# EAGLE design single-supply-bridged (EAGLE 5.10)
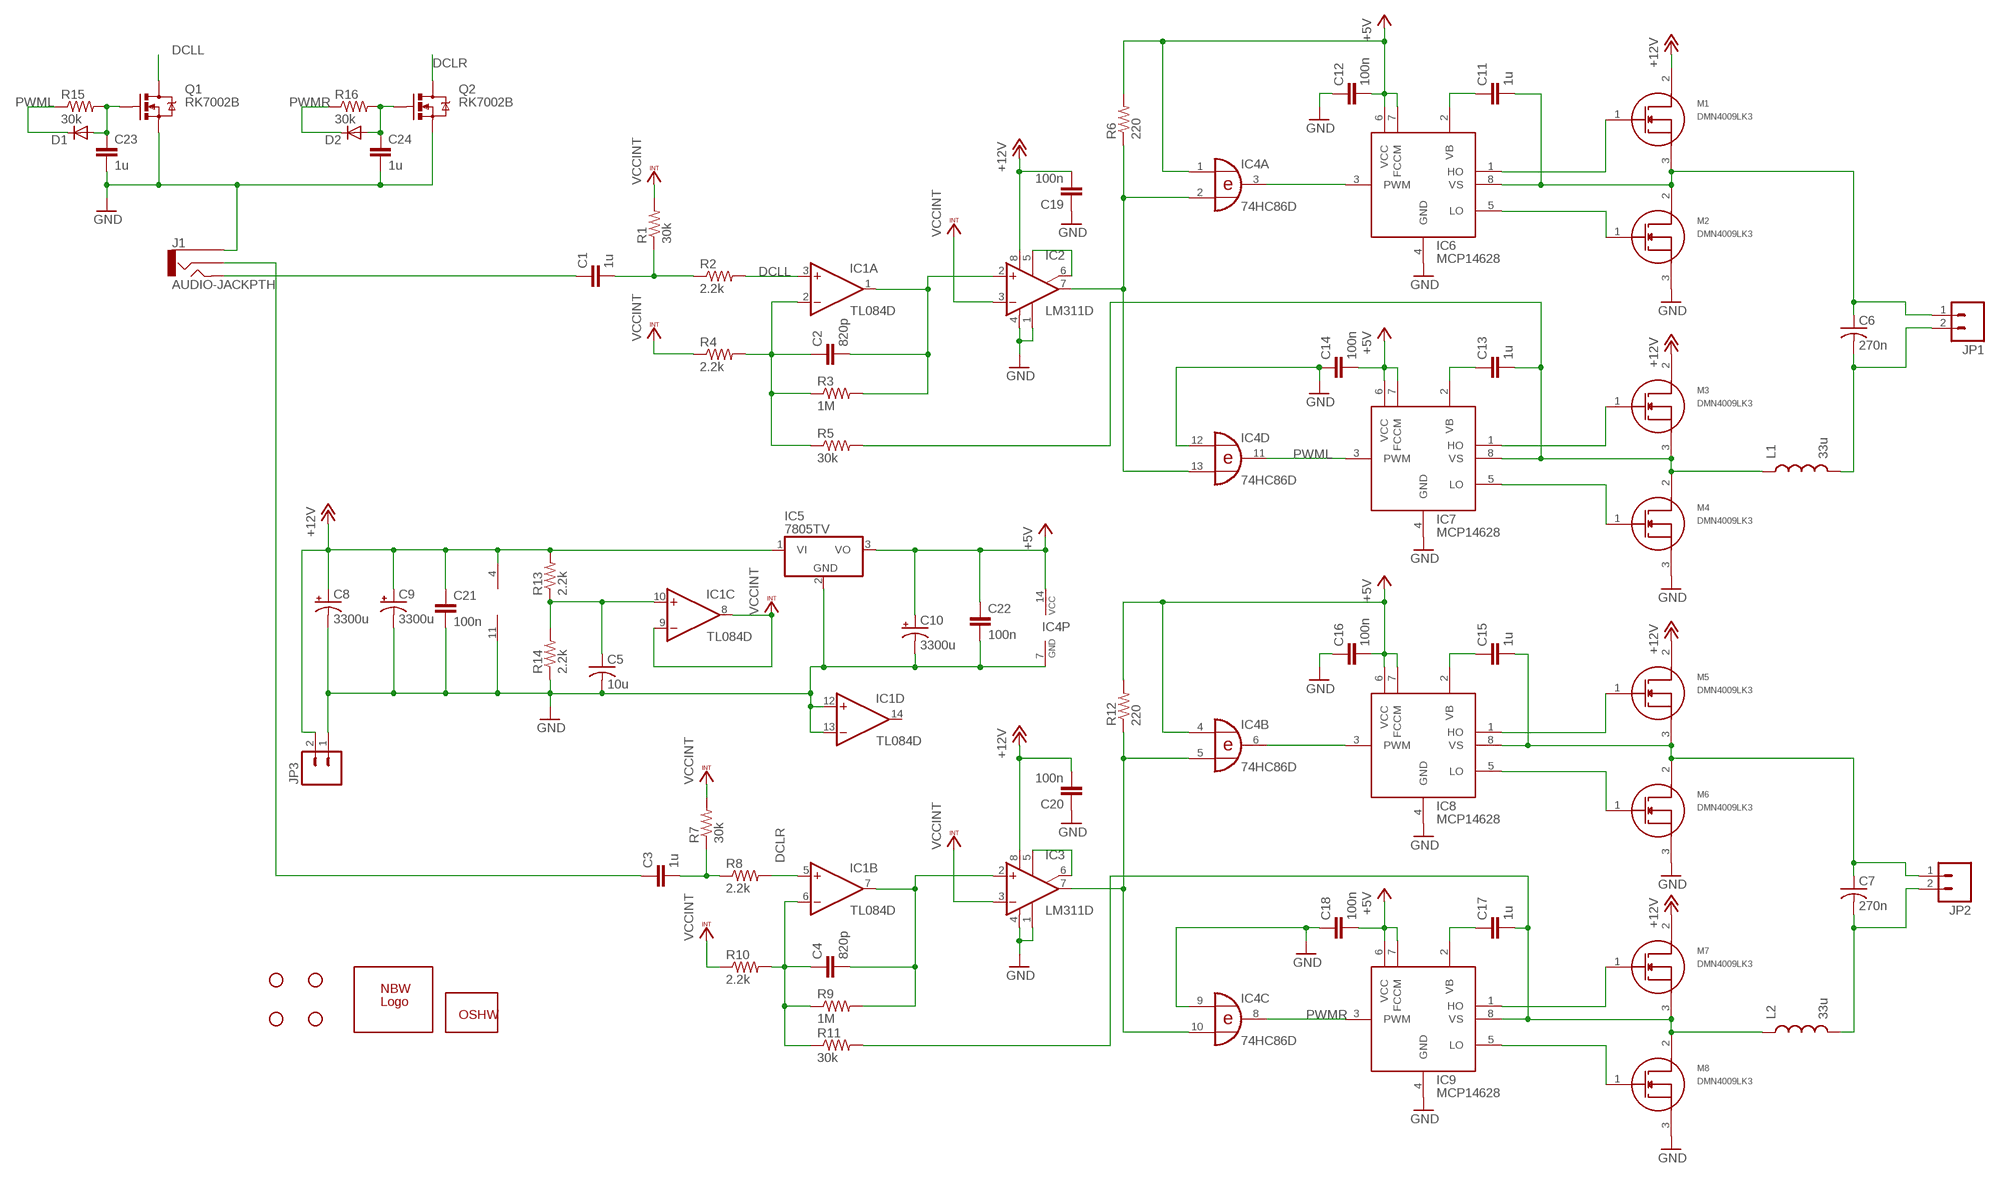
[diagram p0: schematic, sheet 1]

## Parts
C1  1u  CAP0603  [0603]
C2  820p  CAP0603  [0603]
C3  1u  CAP0603  [0603]
C4  820p  CAP0603  [0603]
C5  10u  C-USC0805  [C0805]
C6  270n  C-USC1210K  [C1210K]
C7  270n  C-USC1210K  [C1210K]
C8  3300u  CPOL-USE7.5-18  [E7,5-18]
C9  3300u  CPOL-USE7.5-18  [E7,5-18]
C10  3300u  CPOL-USE7.5-18  [E7,5-18]
C11  1u  CAP0603  [0603]
C12  100n  CAP0603  [0603]
C13  1u  CAP0603  [0603]
C14  100n  CAP0603  [0603]
C15  1u  CAP0603  [0603]
C16  100n  CAP0603  [0603]
C17  1u  CAP0603  [0603]
C18  100n  CAP0603  [0603]
C19  100n  CAP0603  [0603]
C20  100n  CAP0603  [0603]
C21  100n  CAP0603  [0603]
C22  100n  CAP0603  [0603]
C23  1u  CAP0603  [0603]
C24  1u  CAP0603  [0603]
D1  DIODESMB  [SMB-DIODE]
D2  DIODESMB  [SMB-DIODE]
GOLD_ORB_SM1  OSHWLOGO_GOLD_ORB_SM  [OSHW2]
IC1  TL084D  [SO14]
IC2  LM311D  [SO08]
IC3  LM311D  [SO08]
IC4  74HC86D  [SO14]
IC5  7805TV  [TO220V]
IC6  MCP14628  [SO-08]
IC7  MCP14628  [SO-08]
IC8  MCP14628  [SO-08]
IC9  MCP14628  [SO-08]
J1  AUDIO-JACKPTH  [AUDIO-JACK]
JP1  M023.5MM  [SCREWTERMINAL-3.5MM-2]
JP2  M023.5MM  [SCREWTERMINAL-3.5MM-2]
JP3  M023.5MM  [SCREWTERMINAL-3.5MM-2]
L1  33u  INDUCTORPWR  [CDRH125]
L2  33u  INDUCTORPWR  [CDRH125]
M1  DMN4009LK3  [TO252-3L]
M2  DMN4009LK3  [TO252-3L]
M3  DMN4009LK3  [TO252-3L]
M4  DMN4009LK3  [TO252-3L]
M5  DMN4009LK3  [TO252-3L]
M6  DMN4009LK3  [TO252-3L]
M7  DMN4009LK3  [TO252-3L]
M8  DMN4009LK3  [TO252-3L]
Q1  RK7002B  MOSFET-NCHANNELSMD  [SOT23-3]
Q2  RK7002B  MOSFET-NCHANNELSMD  [SOT23-3]
R1  30k  RESISTOR0603  [0603]
R2  2.2k  RESISTOR0603  [0603]
R3  1M  RESISTOR0603  [0603]
R4  2.2k  RESISTOR0603  [0603]
R5  30k  RESISTOR0603  [0603]
R6  220  RESISTOR0603  [0603]
R7  30k  RESISTOR0603  [0603]
R8  2.2k  RESISTOR0603  [0603]
R9  1M  RESISTOR0603  [0603]
R10  2.2k  RESISTOR0603  [0603]
R11  30k  RESISTOR0603  [0603]
R12  220  RESISTOR0603  [0603]
R13  2.2k  RESISTOR0603  [0603]
R14  2.2k  RESISTOR0603  [0603]
R15  30k  RESISTOR0603  [0603]
R16  30k  RESISTOR0603  [0603]
U$1  STAND-OFF  [STAND-OFF]
U$2  STAND-OFF  [STAND-OFF]
U$3  STAND-OFF  [STAND-OFF]
U$4  STAND-OFF  [STAND-OFF]
U$5  NBW_LOGOSMALL  [NBW_LOGO]

## Nets
+12V: C8.+ C9.+ C19.2 C20.2 C21.1 IC1.4(P:V+) IC2.8(V+) IC3.8(V+) IC5.1(VI) JP3.2 M1.2 M3.2 M5.2 M7.2 R13.2
DCLL: IC1.3(A:+IN) Q1.3(D) R2.2
DCLR: IC1.5(B:+IN) Q2.3(D) R8.2
GND: C5.2 C8.- C9.- C10.- C12.1 C14.1 C16.1 C18.1 C19.1 C20.1 C21.2 C22.2 C23.2 C24.2 IC1.11(P:V-) IC1.12(D:+IN) IC1.13(D:-IN) IC2.1(GND) IC2.4(V-) IC3.1(GND) IC3.4(V-) IC4.7(P:GND) IC4.9(C:I0) IC4.12(D:I0) IC5.2(GND) IC6.4(GND) IC7.4(GND) IC8.4(GND) IC9.4(GND) J1.1 JP3.1 M2.3 M4.3 M6.3 M8.3 Q1.2(S) Q2.2(S) R14.1
N$1: C11.1 IC6.2(VB)
N$2: C1.2 R1.1 R2.1
N$3: C6.1 C11.2 IC6.8(VS) JP1.1 M1.3 M2.2
N$4: IC6.1(HO) M1.1
N$5: IC6.5(LO) M2.1
N$6: C13.2 IC7.8(VS) L1.1 M3.3 M4.2 R5.2
N$7: C13.1 IC7.2(VB)
N$8: IC7.1(HO) M3.1
N$9: IC7.5(LO) M4.1
N$10: C10.+ C12.2 C14.2 C16.2 C18.2 C22.1 IC4.1(A:I0) IC4.4(B:I0) IC4.14(P:VCC) IC5.3(VO) IC6.6(VCC) IC6.7(FCCM) IC7.6(VCC) IC7.7(FCCM) IC8.6(VCC) IC8.7(FCCM) IC9.6(VCC) IC9.7(FCCM) R6.2 R12.2 ; supply symbol labelled +5V
N$11: IC4.3(A:O) IC6.3(PWM)
N$12: C1.1 J1.5
N$13: C15.1 IC8.2(VB)
N$14: IC2.5(ON) IC2.6(ON/STR)
N$15: IC8.1(HO) M5.1
N$16: IC8.5(LO) M6.1
N$17: IC4.6(B:O) IC8.3(PWM)
N$18: C3.1 J1.2
N$19: C2.1 IC1.2(A:-IN) R3.1 R4.2 R5.1
N$20: C2.2 IC1.1(A:OUT) IC2.2(+IN) R3.2
N$21: C17.1 IC9.2(VB)
N$22: C17.2 IC9.8(VS) L2.1 M7.3 M8.2 R11.2
N$23: IC9.1(HO) M7.1
N$24: IC9.5(LO) M8.1
N$25: C7.2 JP2.2 L2.2
N$26: IC2.7(OUT) IC4.2(A:I1) IC4.13(D:I1) R6.1
N$27: C6.2 JP1.2 L1.2
N$28: C24.1 D2.A Q2.1(G) R16.2
N$29: C23.1 D1.A Q1.1(G) R15.2
N$30: IC3.5(ON) IC3.6(ON/STR)
N$32: IC3.7(OUT) IC4.5(B:I1) IC4.10(C:I1) R12.1
N$33: C3.2 R7.1 R8.1
N$35: C4.1 IC1.6(B:-IN) R9.1 R10.2 R11.1
N$36: C4.2 IC1.7(B:OUT) IC3.2(+IN) R9.2
N$37: C7.1 C15.2 IC8.8(VS) JP2.1 M5.3 M6.2
N$42: C5.1 IC1.10(C:+IN) R13.1 R14.2
PWML: D1.C IC4.11(D:O) IC7.3(PWM) R15.1
PWMR: D2.C IC4.8(C:O) IC9.3(PWM) R16.1
VCCINT: IC1.8(C:OUT) IC1.9(C:-IN) IC2.3(-IN) IC3.3(-IN) R1.2 R4.1 R7.2 R10.1
Unconnected: IC1.14(D:OUT)

## Library data of the parts
C1-C4 C11-C24 = SparkFun:CAP: Capacitor Standard 0603 ceramic capacitor, and 0.1" leaded capacitor.
C5-C7 = rcl:C-US: CAPACITOR, American symbol
C8-C10 = rcl:CPOL-US: POLARIZED CAPACITOR, American symbol
D1 D2 = SparkFun:DIODE: Diode These are standard reverse protection diodes and small signal diodes. SMA package can handle up to about 1A. SOD-323 can handle about 200mA. What the SOD-323 package when ordering, there are some mfgs out there that are 5-pin packages.
GOLD_ORB_SM1 = NBitWonder:OSHWLOGO: These are Open-Source Hardware logos.
IC1 = linear:TL084: OP AMP
IC2 IC3 = linear:LM311: COMPARATOR
IC4 = 74xx-eu:74*86: Quad 2-input EXCLUSIVE-OR (XOR) gate
IC5 = linear:78*: Positive VOLTAGE REGULATOR Source: http://cache.national.com/ds/LM/LM78L05.pdf http://www.fairchildsemi.com/ds/LM/LM7805.pdf
IC6-IC9 = NBitWonder:MCP14628
J1 = SparkFun:AUDIO-JACK: 3.5mm Audio Jack Simple 3.5mm common PCB mount audio jack. SKU: PRT-08032
JP1-JP3 = SparkFun:M02: Header 2 Standard 2-pin 0.1" header. Use with straight break away headers (SKU : PRT-00116), right angle break away headers (PRT-00553), swiss pins (PRT-00743), machine pins (PRT-00117), and female headers (PRT-00115). Molex polarized connector foot print use with SKU : PRT-08233 with associated crimp pins and housings.
L1 L2 = SparkFun:INDUCTOR: Inductors Basic Inductor/Choke - 0603 and 1206. Footprints are not proven and vary greatly between part numbers.
M1-M8 = NBitWonder:DMN4009LK3
Q1 Q2 = SparkFun:MOSFET-NCHANNEL
R1-R16 = SparkFun:RESISTOR: Resistor Basic schematic elements and footprints for 0603, 1206, and PTH 1/10th watt (small) resistors.
U$1-U$4 = SparkFun:STAND-OFF: Stand Off This is the mechanical footprint for a #4 phillips button head screw. Use the keepout ring to avoid running the screw head into surrounding components. SKU : PRT-00447
U$5 = NBitWonder:NBW_LOGO

## Board
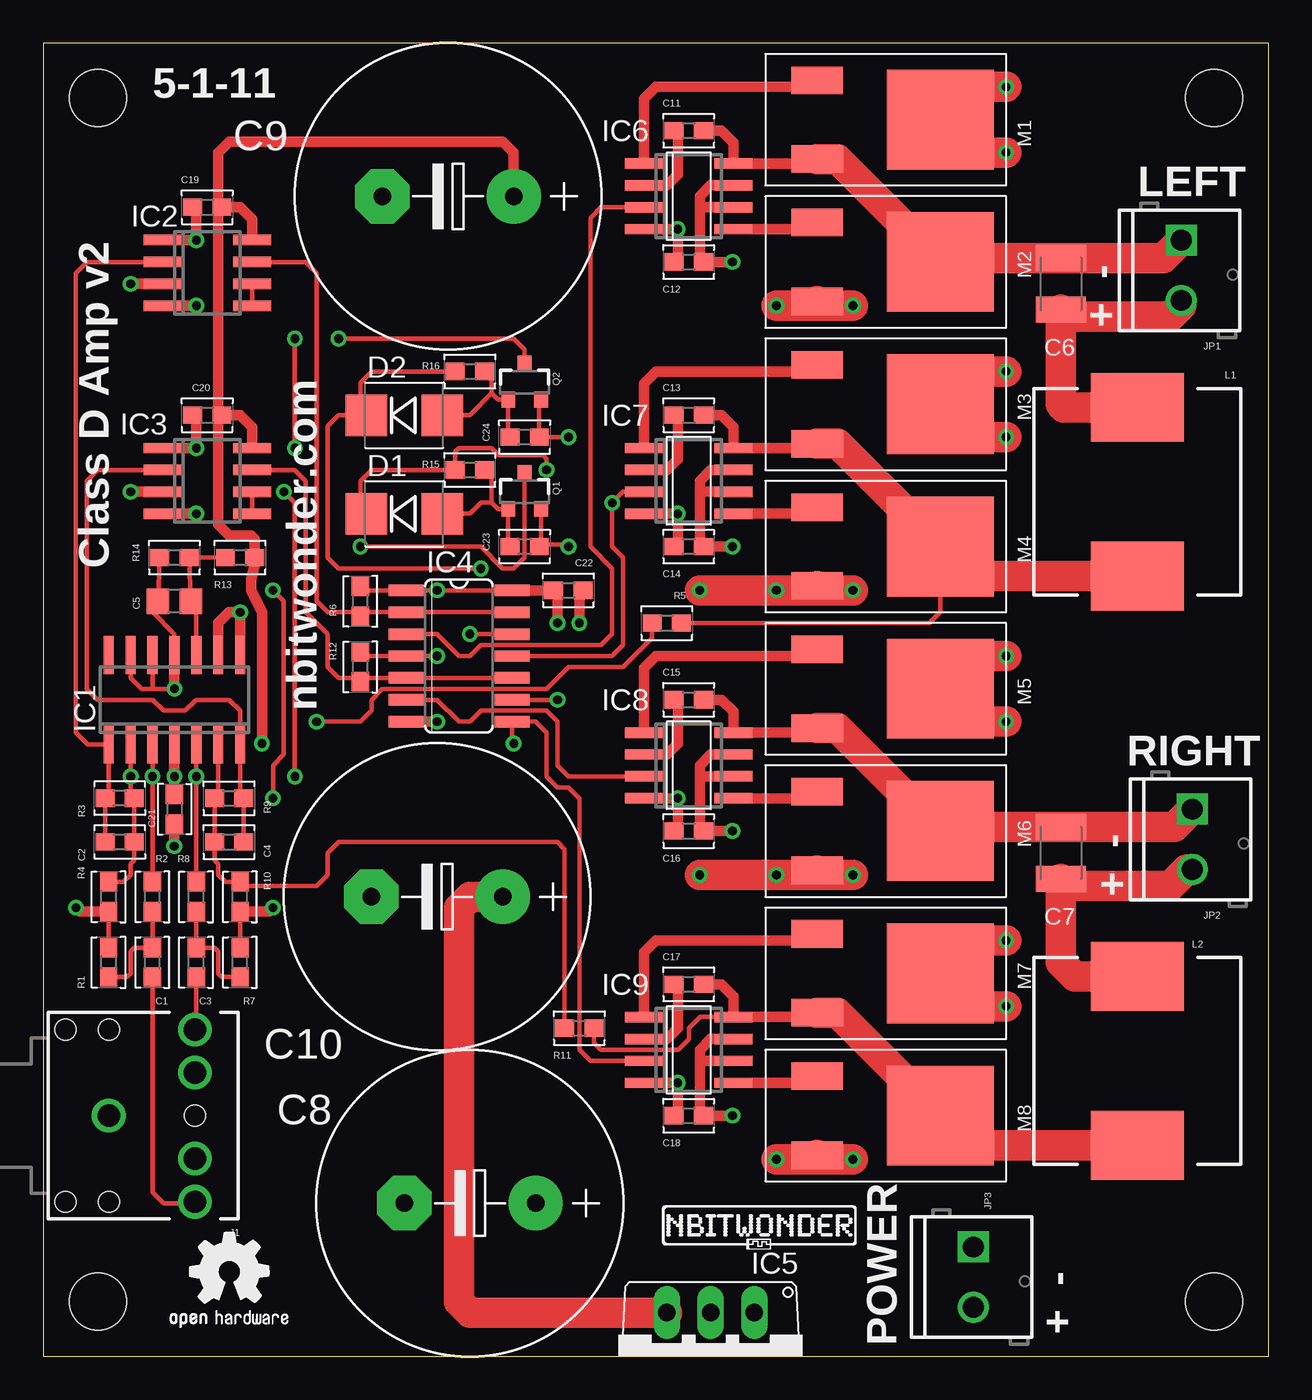
[diagram p1: board, top side]
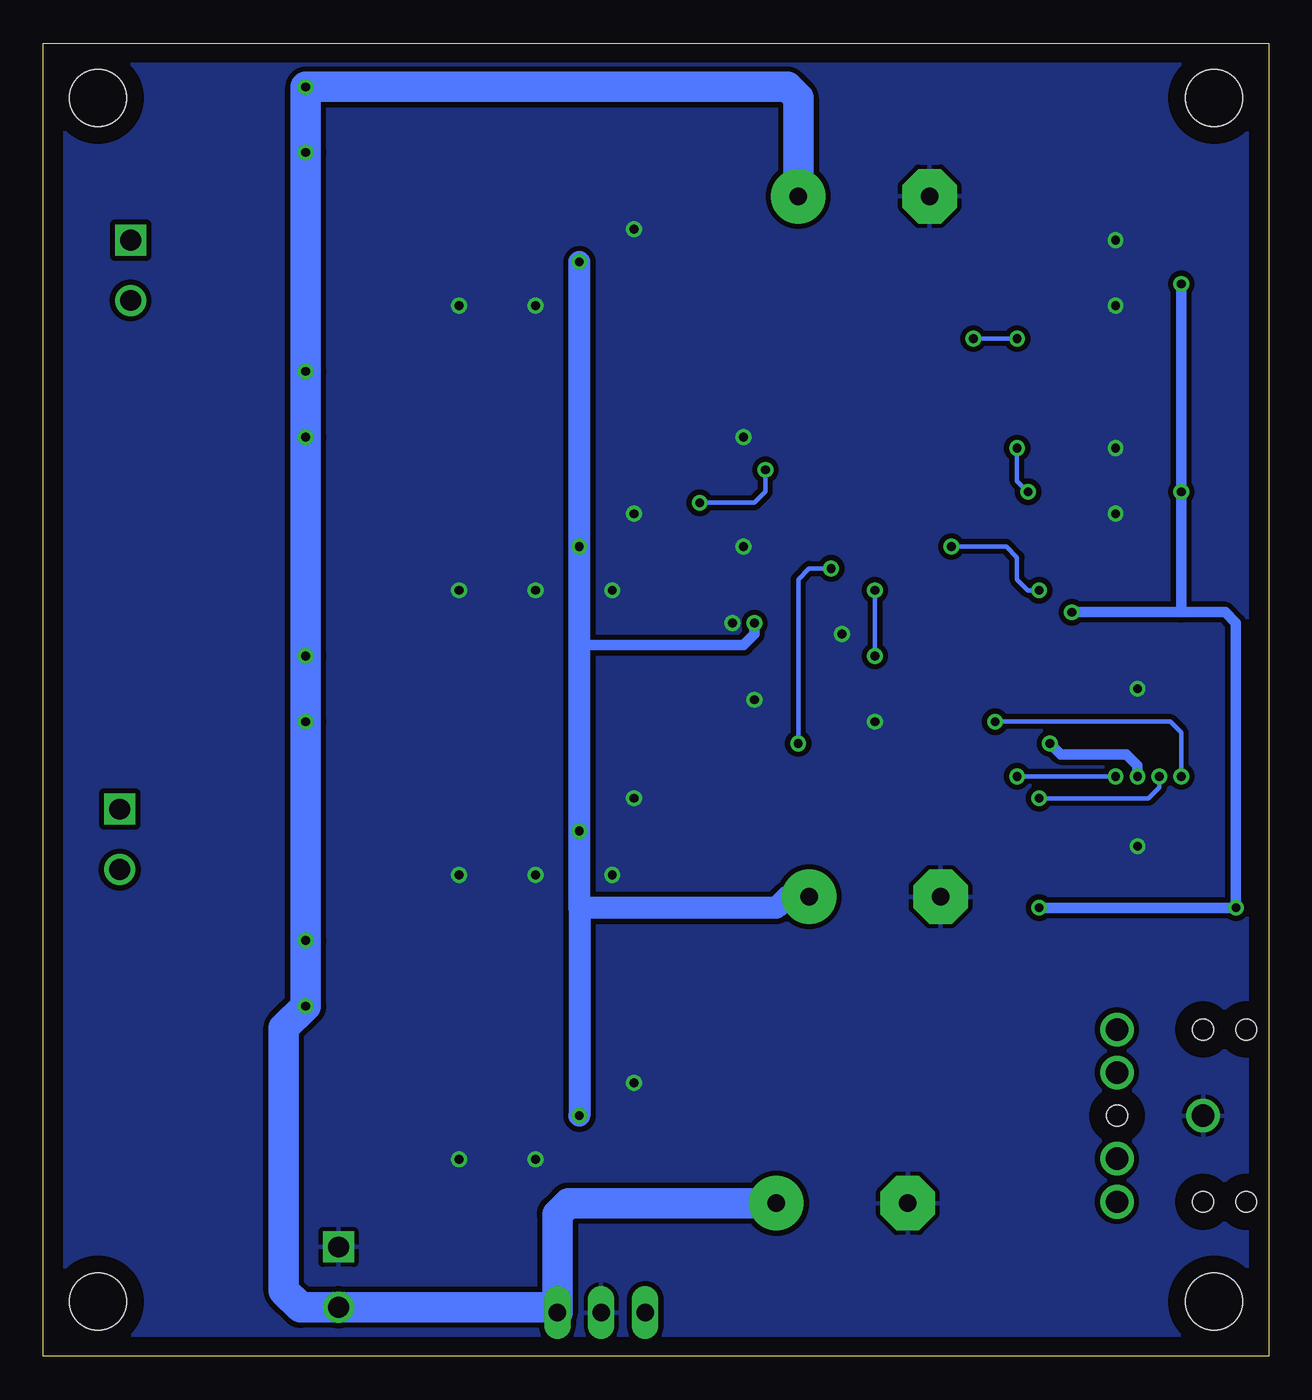
[diagram p2: board, bottom side, seen from below]

Size 71.12 x 76.2 mm. Coordinates in mm from the lower left corner, seen from the top.
Outline: 0,0 71.12,0 71.12,76.2 0,76.2 0,0
Copper layers (1*16): Top 0.035mm / dielectric 1.5mm / Bottom 0.035mm
Design rules "default *": minimum track width 10mil, minimum drill 24mil, track to track 8mil, track to pad 8mil, pad to pad 8mil, via to via 8mil, smd to smd 8mil, copper to edge 40mil, drill to drill 8mil, minimum pad ring 10mil, minimum via ring 8mil, stop-mask expansion 4mil, vias tented up to drill 20mil, thermal gap 10mil

### Footprints (pad centres in the part's own frame; a part is rotated, then mirrored left to right if it is on the bottom)
0603 = smd 1.1 x 1: 1 -0.85,0; 2 0.85,0
C0805 = smd 1.3 x 1.5: 1 -0.95,0; 2 0.95,0
C1210K = smd 1.5 x 2.9: 1 -1.5,0; 2 1.5,0
E7,5-18 = drill 1.016 pad 3.15 round: + -3.81,0 | drill 1.016 pad 3.15 octagon: - 3.81,0
SMB-DIODE = smd 2.4 x 2.4: A 2.2,0; C -2.2,0
SO14 = smd 0.6 x 2.2: 1 -3.81,-2.6; 2 -2.54,-2.6; 3 -1.27,-2.6; 4 0,-2.6; 5 1.27,-2.6; 6 2.54,-2.6; 7 3.81,-2.6; 8 3.81,2.6; 9 2.54,2.6; 10 1.27,2.6; 11 0,2.6; 12 -1.27,2.6; 13 -2.54,2.6; 14 -3.81,2.6
SO08 = smd 0.6 x 2.2: 1 -1.905,-2.6; 2 -0.635,-2.6; 3 0.635,-2.6; 4 1.905,-2.6; 5 1.905,2.6; 6 0.635,2.6; 7 -0.635,2.6; 8 -1.905,2.6
SO14' = smd 0.66 x 2.032: 1 -3.81,-3.073; 2 -2.54,-3.073; 3 -1.27,-3.073; 4 0,-3.073; 5 1.27,-3.073; 6 2.54,-3.073; 7 3.81,-3.073; 8 3.81,3.073; 9 2.54,3.073; 10 1.27,3.073; 11 0,3.073; 12 -1.27,3.073; 13 -2.54,3.073; 14 -3.81,3.073
TO220V = drill 1.016 long: 1 -2.54,-2.54; 2 0,-2.54; 3 2.54,-2.54
SO-08 = smd 0.6 x 2.2: 1 -1.905,-2.6; 2 -0.635,-2.6; 3 0.635,-2.6; 4 1.905,-2.6; 5 1.905,2.6; 6 0.635,2.6; 7 -0.635,2.6; 8 -1.905,2.6
AUDIO-JACK = drill 1.3 round: 1 0,0; 2 5,5; 3 5,2.5; 4 5,-2.5; 5 5,-5 | hole 1.2: 0,5; -2.5,5; -2.5,-5; 0,-5; 5,0
SCREWTERMINAL-3.5MM-2 = drill 1.2 square: 1 0,0 | drill 1.2 round: 2 3.5,0
CDRH125 = smd 5.4 x 4: 1 0,4.9; 2 0,-4.9
TO252-3L = smd 2.997 x 1.6: 1 7.163,-2.286; 3 7.163,2.286 | smd 6.198 x 5.791: 2 0,0
SOT23-3 = smd 0.8 x 0.9: 1 -0.95,-1; 2 0.95,-1; 3 0,1.1
STAND-OFF = hole 3.302: 0,0

### Placement (x,y rotation side)
C1  6.35,22.86 90 top
C2  4.45,29.84 180 top
C3  8.89,22.86 90 top
C4  10.79,29.84 0 top
C5  7.62,43.81 180 top
C6  59.05,62.23 270 top
C7  59.05,29.21 270 top
C8  24.77,8.89 180 top
C9  23.5,67.31 180 top
C10  22.86,26.67 180 top
C11  37.47,71.12 0 top
C12  37.47,63.5 0 top
C13  37.47,54.61 0 top
C14  37.47,46.99 0 top
C15  37.47,38.1 0 top
C16  37.47,30.48 0 top
C17  37.47,21.59 0 top
C18  37.47,13.97 0 top
C19  9.53,66.67 0 top
C20  9.53,54.61 0 top
C21  7.62,31.75 270 top
C22  30.48,44.45 0 top
C23  27.94,46.99 0 top
C24  27.94,53.34 0 top
D1  20.95,48.9 0 top
D2  20.95,54.61 0 top
GOLD_ORB_SM1  6.99,0.64 0 top
IC1  7.62,38.1 0 top
IC2  9.53,62.87 270 top
IC3  9.53,50.8 270 top
IC4  74HC86D  [SO14']  24.13,40.64 270 top
IC5  38.73,0 180 top
IC6  37.47,67.31 270 top
IC7  37.47,50.8 270 top
IC8  37.47,34.29 270 top
IC9  37.47,17.78 270 top
J1  3.81,13.97 0 top
JP1  66.04,64.77 270 top
JP2  66.67,31.75 270 top
JP3  53.98,6.35 270 top
L1  63.5,50.16 180 top
L2  63.5,17.14 180 top
M1  52.07,71.75 180 top
M2  52.07,63.5 180 top
M3  52.07,55.24 180 top
M4  52.07,46.99 180 top
M5  52.07,38.73 180 top
M6  52.07,30.48 180 top
M7  52.07,22.23 180 top
M8  52.07,13.97 180 top
Q1  27.94,50.16 0 top
Q2  27.94,56.52 0 top
R1  3.81,22.86 90 top
R2  6.35,26.67 90 top
R3  4.45,32.38 180 top
R4  3.81,26.67 90 top
R5  36.2,42.55 0 top
R6  18.41,43.81 90 top
R7  11.43,22.86 90 top
R8  8.89,26.67 90 top
R9  10.79,32.38 0 top
R10  11.43,26.67 90 top
R11  31.11,19.05 0 top
R12  18.41,40.01 90 top
R13  11.43,46.35 0 top
R14  7.62,46.35 0 top
R15  24.77,51.44 0 top
R16  24.77,57.15 0 top
U$1  3.17,3.17 0 top
U$2  3.17,73.03 0 top
U$3  67.94,3.17 0 top
U$4  67.94,73.03 0 top
U$5  35.56,5.71 0 top

### Tracks (layer width: path | path; a pad name or v marks a point on that pad's centre or on a via)
+12V  (via drill 0.51)
  Top 0.254: C20.2 10.16,54.4
  Top 0.61: C21.1 v7.62,33.66 IC1.4 | IC2.8 12.12,65.98 11.43,66.67 C19.2 | IC3.8 12.12,53.91 11.43,54.61 C20.2 10.16,54.61 10.16,66.46 C19.2 | 10.16,54.4 10.16,48.26 10.79,47.62 12.06,47.62 12.28,47.41 R13.2 12.28,45.94 12.06,45.09 12.06,44.45 12.7,43.18 v12.7,35.56 | C9.+ 27.3,69.85 26.67,70.48 10.79,70.48 10.16,69.85 10.16,66.89 C19.2
  Top 1.778: v55.88,73.66 54.61,73.66 52.7,71.75 M1.2 53.98,69.85 v55.88,69.85 | v55.88,57.15 53.98,57.15 M3.2 53.98,53.34 v55.88,53.34 | v55.88,40.64 53.98,40.64 M5.2 53.98,36.83 v55.88,36.83 | v55.88,24.13 53.98,24.13 M7.2 53.98,20.32 v55.88,20.32
  Bottom 0.61: v7.62,33.66 7.62,34.29 8.26,34.92 12.06,34.92 v12.7,35.56
  Bottom 1.778: C9.+ 27.3,73.03 27.94,73.66 v55.88,73.66 v55.88,69.85 v55.88,57.15 v55.88,53.34 v55.88,40.64 v55.88,36.83 v55.88,24.13 v55.88,20.32 57.15,19.05 57.15,3.81 56.19,2.85 JP3.2 41.59,2.85 IC5.1 41.27,8.26 40.64,8.89 C8.+
DCLL  (via drill 0.51)
  Top 0.254: R2.2 v6.35,33.66 IC1.3 | Q1.3 27.94,46.35 27.3,45.72 26.67,45.72 25.4,46.99 v18.41,46.99 | v13.34,44.45 13.97,43.81 13.97,34.92 13.34,34.29 v13.34,32.38
  Bottom 0.254: v18.41,46.99 15.24,46.99 14.61,46.35 14.61,45.09 13.97,44.45 v13.34,44.45 | v13.34,32.38 6.99,32.38 6.35,33.02 v6.35,33.66
DCLR  (via drill 0.51)
  Top 0.254: R8.2 v8.89,33.66 IC1.5 | Q2.3 27.94,58.42 27.3,59.05 v17.14,59.05 | v14.61,52.7 v14.61,59.05 | v13.97,50.16 14.61,49.53 v14.61,33.66
  Bottom 0.254: v14.61,59.05 v17.14,59.05 | v14.61,52.7 14.61,50.8 v13.97,50.16 | v8.89,33.66 v14.61,33.66
GND  (via drill 0.51)
  Top 0.254: IC1.13 5.08,39.37 5.71,38.73 6.35,38.73 | 6.35,38.73 v7.62,38.73 | 6.35,38.73 IC1.12 | R14.1 C5.2 6.35,43.81 6.35,43.18 7.62,41.91 7.62,40.64 | 28.89,47.09 Q1.2 | C23.2 28.89,47.09 | Q2.2 28.79,55.41 C24.2 v30.48,53.34 | v24.77,41.91 IC4.12 | 28.89,47.09 30.38,47.09 v30.48,46.99 | IC4.9 v29.84,38.1
  Top 0.61: C21.2 v7.62,29.62 v7.61,29.61 | v7.62,38.73 7.62,40.64 IC1.11 | IC2.1 v8.89,64.77 8.89,66.46 C19.1 | IC2.4 v8.89,60.96 | IC3.1 v8.89,52.7 8.89,54.4 C20.1 | IC3.4 v8.89,48.9 | IC4.7 v22.86,36.83 | IC6.4 v36.83,65.41 36.83,63.72 C12.1 | IC7.4 v36.83,48.9 36.83,47.2 C14.1 | IC8.4 v36.83,32.38 36.83,30.7 C16.1 | IC9.4 v36.83,15.88 36.83,14.19 C18.1 | v31.11,42.55 31.11,44.23 C22.2
  Top 1.778: 44.65,27.94 v46.99,27.94 | v38.1,27.94 v42.55,27.94 44.65,27.94 | 44.65,27.94 M6.3 | v42.55,44.45 v46.99,44.45 | v38.1,44.45 v42.55,44.45 | v42.55,44.45 44.65,44.45 M4.3 | v46.99,60.96 v42.55,60.96 44.65,60.96 M2.3 | v46.99,11.43 v42.55,11.43 44.65,11.43 M8.3
  pour Bottom (isolate 0.305): 1.27,1.27 69.85,1.27 69.85,74.93 1.27,74.93
N$1
  Top 0.61: IC6.2 36.2,67.94 36.83,68.58 36.83,70.91 C11.1
N$2
  Top 0.254: R2.1 C1.2 5.29,23.71 5.08,23.5 5.08,22.23 4.87,22.01 R1.1
N$3
  Top 0.61: M1.3 44.53,69.85 44.45,69.85 43.81,69.22 IC6.8 40.06,70.42 39.37,71.12 C11.2
  Top 1.778: M1.3 46.1,69.47 M2.2 52.3,63.73 C6.1 65,63.73 JP1.1
N$4
  Top 0.61: IC6.1 34.87,72.97 35.56,73.66 44.53,73.66 M1.1
N$5
  Top 0.61: IC6.5 44.53,65.41 M2.1
N$6
  Top 0.254: R5.2 51.44,42.55 52.07,43.18 M4.2
  Top 0.61: M3.3 44.65,52.7 IC7.8 40.06,53.91 39.37,54.61 C13.2
  Top 1.778: M3.3 46.1,52.96 M4.2 53.8,45.27 L1.1
N$7
  Top 0.61: IC7.2 36.2,51.44 36.83,52.07 36.83,54.4 C13.1
N$8
  Top 0.61: IC7.1 34.87,56.45 35.56,57.15 44.53,57.15 M3.1
N$9
  Top 0.61: IC7.5 44.53,48.9 M4.1
N$10  (via drill 0.51)
  Top 0.254: IC4.14 v22.86,44.45 IC4.1 18.63,44.45 R6.2 | R12.2 18.63,40.64 IC4.4 v22.86,40.64
  Top 0.61: IC4.14 C22.1 29.84,44.23 v29.84,42.55 | IC9.7 38.73,18.41 38.1,17.78 38.1,17.14 | 38.1,17.14 38.1,14.19 C18.2 v40.01,13.97 | 38.1,17.14 IC9.6 | IC8.7 38.73,34.92 38.1,34.29 38.1,33.66 | 38.1,33.66 38.1,30.7 C16.2 v40.01,30.48 | 38.1,33.66 IC8.6 | IC7.7 38.73,51.44 38.1,50.8 38.1,50.16 | 38.1,50.16 38.1,47.2 C14.2 v40.01,46.99 | 38.1,50.16 IC7.6 | IC6.7 38.73,67.94 38.1,67.31 38.1,66.67 | 38.1,66.67 38.1,63.72 C12.2 v40.01,63.5 | 38.1,66.67 IC6.6
  Top 1.778: IC5.3 24.77,2.54 24.13,3.17 24.13,26.04 24.77,26.67 C10.+
  Bottom 0.254: v22.86,44.45 v22.86,40.64
  Bottom 0.61: v29.84,42.55 29.84,41.91 30.48,41.27 40.01,41.27
  Bottom 1.27: v40.01,63.5 v40.01,46.99 40.01,41.27 v40.01,30.48 40.01,26.04 | 40.01,26.04 v40.01,13.97 | C10.+ 27.94,26.67 28.57,26.04 40.01,26.04
N$11
  Top 0.254: IC4.3 22.86,41.91 24.13,40.64 24.77,40.64 25.4,41.27 32.38,41.27 33.02,41.91 33.02,45.72 31.75,46.99 31.75,66.04 32.38,66.67 IC6.3
N$12
  Top 0.254: C1.1 6.35,9.53 6.99,8.89 8.73,8.89 J1.5
N$13
  Top 0.61: IC8.2 36.2,34.92 36.83,35.56 36.83,37.88 C15.1
N$14
  Top 0.254: IC2.6 IC2.5
N$15
  Top 0.61: IC8.1 34.87,39.95 35.56,40.64 44.53,40.64 M5.1
N$16
  Top 0.61: IC8.5 44.53,32.38 M6.1
N$17
  Top 0.254: IC4.6 22.86,38.1 24.13,36.83 24.77,36.83 25.4,37.47 29.21,37.47 29.84,36.83 29.84,34.29 30.48,33.66 IC8.3
N$18
  Top 0.254: C3.1 8.89,19.05 J1.2
N$19  (via drill 0.51)
  Top 0.254: R4.2 4.66,27.52 5.08,27.94 5.08,28.57 5.29,28.79 C2.1 R3.1 5.08,32.6 v5.08,33.66 IC1.2 | R5.1 35.34,41.7 33.66,40.01 30.48,40.01 29.21,38.73 19.68,38.73 19.05,38.1 19.05,37.47 18.41,36.83 v15.88,36.83
  Bottom 0.254: v5.08,33.66 5.08,36.2 5.71,36.83 v15.88,36.83
N$20
  Top 0.254: C2.2 R3.2 3.81,32.6 IC1.1 2.6,35.5 1.91,36.2 1.91,62.87 2.54,63.5 IC2.2
N$21
  Top 0.61: IC9.2 36.2,18.41 36.83,19.05 36.83,21.38 C17.1
N$22
  Top 0.254: R11.2 31.96,18.2 32.38,17.78 36.83,17.78 37.47,18.41 37.47,19.05 38.1,19.68 IC9.8
  Top 0.61: M7.3 44.65,19.68 IC9.8 40.06,20.89 39.37,21.59 C17.2
  Top 1.778: M7.3 46.1,19.94 M8.2 53.8,12.24 L2.1
N$23
  Top 0.61: IC9.1 34.87,23.43 35.56,24.13 44.53,24.13 M7.1
N$24
  Top 0.61: IC9.5 44.53,15.88 M8.1
N$25
  Top 1.778: L2.2 59.87,22.05 59.05,22.86 C7.2 59.46,27.3 65.41,27.3 66.35,28.25 JP2.2
N$26
  Top 0.254: IC4.13 IC4.2 18.63,43.18 R6.1 18.2,43.18 16.51,43.18 15.88,43.81 15.88,62.87 15.24,63.5 IC2.7
N$27
  Top 1.778: JP1.2 66.04,60.96 65.41,60.33 59.46,60.33 C6.2 59.05,55.24 59.23,55.06 L1.2
N$28
  Top 0.254: C24.1 26.99,53.44 Q2.1 26.4,55.52 26.04,55.88 | 26.04,55.88 26.04,56.73 R16.2 | D2.A 24.77,54.61 26.04,55.88
N$29
  Top 0.254: C23.1 26.99,47.09 Q1.1 26.4,49.16 26.04,49.53 | 26.04,49.53 26.04,51.02 R15.2 | D1.A 24.77,48.9 25.4,49.53 26.04,49.53
N$30
  Top 0.254: IC3.6 IC3.5
N$32
  Top 0.254: IC4.10 IC4.5 18.63,39.37 R12.1 18.2,39.37 17.14,39.37 16.51,40.01 16.51,41.91 15.24,43.18 15.24,50.8 14.61,51.44 IC3.7
N$33
  Top 0.254: R8.1 C3.2 9.95,23.71 10.16,23.5 10.16,22.23 10.38,22.01 R7.1
N$35
  Top 0.254: IC1.6 10.16,32.6 R9.1 C4.1 9.95,28.79 10.16,28.57 10.16,27.94 10.58,27.52 R10.2 11.64,27.3 15.88,27.3 16.51,27.94 16.51,29.21 17.14,29.84 29.84,29.84 30.27,29.43 R11.1
N$36
  Top 0.254: C4.2 R9.2 11.43,32.6 IC1.7 11.43,37.47 10.79,38.1 8.89,38.1 8.26,37.47 6.99,37.47 6.35,38.1 3.17,38.1 2.54,38.73 2.54,50.8 3.17,51.44 IC3.2
N$37
  Top 0.61: M5.3 44.65,36.2 IC8.8 40.06,37.41 39.37,38.1 C15.2
  Top 1.778: JP2.1 65.64,30.71 C7.1 52.3,30.71 M6.2 46.1,36.45 M5.3
N$42
  Top 0.254: IC1.10 8.89,43.6 C5.1 R14.2 R13.1
PWML  (via drill 0.51)
  Top 0.254: D1.C 18.41,49.23 18.41,50.8 19.05,51.44 R15.1 23.91,52.49 24.13,52.7 26.01,52.7 26.44,52.28 29,52.28 29.21,52.07 v29.21,51.44 | IC4.11 33.02,40.64 33.66,41.27 33.66,46.35 33.02,46.99 v33.02,49.53 33.66,50.16 IC7.3
  Bottom 0.254: v33.02,49.53 29.84,49.53 29.21,50.16 v29.21,51.44
PWMR  (via drill 0.51)
  Top 0.254: R16.1 19.05,57.15 18.41,56.52 18.41,54.95 D2.C 17.14,54.61 16.51,53.98 16.51,46.35 17.14,45.72 v25.4,45.72 | IC9.3 31.75,17.14 31.11,17.78 31.11,32.38 30.48,33.02 29.84,33.02 29.21,33.66 29.21,36.2 28.57,36.83 IC4.8 27.2,35.66 v27.3,35.56
  Bottom 0.254: v27.3,35.56 27.3,45.09 26.67,45.72 v25.4,45.72
VCCINT  (via drill 0.51)
  Top 0.254: R1.2 R4.1 | R10.1 R7.2
  Top 0.61: IC1.8 v11.43,43.18 10.79,43.18 10.16,42.55 IC1.9 | v5.08,62.23 IC2.3 | v5.08,50.16 IC3.3 | R4.1 2.12,25.82 v1.91,26.04 | R10.1 13.12,25.82 v13.34,26.04
  Bottom 0.61: v5.08,62.23 v5.08,50.16 5.08,43.18 | 5.08,43.18 v11.43,43.18 | v13.34,26.04 v1.91,26.04 1.91,42.55 2.54,43.18 5.08,43.18

### Text on the board
tNames: 5-1-11 | LEFT | + - | Class D Amp v2 | nbitwonder.com | RIGHT | + - | POWER | + -